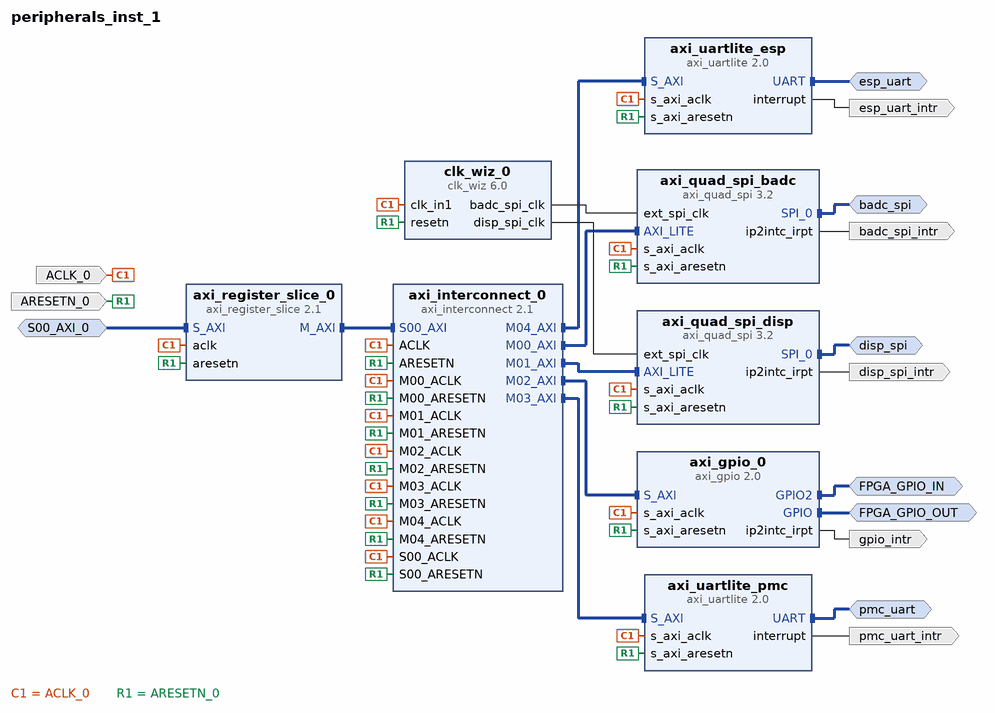
[diagram p0: block diagram of the top level]
# Vivado block design peripherals_inst_1, xc7z020clg484-2, Vivado 2024.1
create_bd_design peripherals_inst_1

create_bd_intf_port -mode Master -vlnv xilinx.com:interface:gpio_rtl:1.0 FPGA_GPIO_IN
create_bd_intf_port -mode Master -vlnv xilinx.com:interface:gpio_rtl:1.0 FPGA_GPIO_OUT
create_bd_intf_port -mode Master -vlnv xilinx.com:interface:spi_rtl:1.0 disp_spi
create_bd_intf_port -mode Master -vlnv xilinx.com:interface:spi_rtl:1.0 badc_spi
create_bd_intf_port -mode Slave -vlnv xilinx.com:interface:aximm_rtl:1.0 S00_AXI_0
create_bd_intf_port -mode Master -vlnv xilinx.com:interface:uart_rtl:1.0 pmc_uart
create_bd_intf_port -mode Master -vlnv xilinx.com:interface:uart_rtl:1.0 esp_uart
create_bd_port -dir I -type clk ACLK_0
create_bd_port -dir I -type rst ARESETN_0
create_bd_port -dir O -type intr pmc_uart_intr
create_bd_port -dir O -type intr esp_uart_intr
create_bd_port -dir O -type intr gpio_intr
create_bd_port -dir O -type intr disp_spi_intr
create_bd_port -dir O -type intr badc_spi_intr

create_bd_cell -type ip -vlnv xilinx.com:ip:clk_wiz:6.0 clk_wiz_0
set_property -dict [list \
  CONFIG.CLKIN1_JITTER_PS 500.0 \
  CONFIG.CLKIN1_UI_JITTER 0.1 \
  CONFIG.CLKIN2_JITTER_PS 100.0 \
  CONFIG.CLKIN2_UI_JITTER 0.010 \
  CONFIG.CLKOUT1_DRIVES BUFG \
  CONFIG.CLKOUT1_JITTER 1240.491 \
  CONFIG.CLKOUT1_PHASE_ERROR 313.282 \
  CONFIG.CLKOUT1_REQUESTED_OUT_FREQ 10 \
  CONFIG.CLKOUT2_DRIVES BUFG \
  CONFIG.CLKOUT2_JITTER 1054.702 \
  CONFIG.CLKOUT2_PHASE_ERROR 313.282 \
  CONFIG.CLKOUT2_REQUESTED_OUT_FREQ 20 \
  CONFIG.CLKOUT2_USED true \
  CONFIG.CLKOUT3_DRIVES BUFG \
  CONFIG.CLKOUT3_JITTER 1138.038 \
  CONFIG.CLKOUT3_PHASE_ERROR 155.540 \
  CONFIG.CLKOUT3_REQUESTED_OUT_FREQ 100.000 \
  CONFIG.CLKOUT3_USED false \
  CONFIG.CLKOUT4_DRIVES BUFG \
  CONFIG.CLKOUT4_JITTER 1138.038 \
  CONFIG.CLKOUT4_PHASE_ERROR 155.540 \
  CONFIG.CLKOUT4_REQUESTED_OUT_FREQ 100.000 \
  CONFIG.CLKOUT4_USED false \
  CONFIG.CLKOUT5_DRIVES BUFG \
  CONFIG.CLKOUT5_JITTER 675.381 \
  CONFIG.CLKOUT5_PHASE_ERROR 155.540 \
  CONFIG.CLKOUT5_REQUESTED_OUT_FREQ 100.000 \
  CONFIG.CLKOUT5_USED false \
  CONFIG.CLKOUT6_DRIVES BUFG \
  CONFIG.CLKOUT6_JITTER 214.814 \
  CONFIG.CLKOUT6_PHASE_ERROR 87.180 \
  CONFIG.CLKOUT6_REQUESTED_OUT_FREQ 100.000 \
  CONFIG.CLKOUT6_USED false \
  CONFIG.CLKOUT7_DRIVES BUFG \
  CONFIG.CLK_OUT1_PORT badc_spi_clk \
  CONFIG.CLK_OUT2_PORT disp_spi_clk \
  CONFIG.CLK_OUT3_PORT clk_out3 \
  CONFIG.CLK_OUT4_PORT clk_out4 \
  CONFIG.CLK_OUT5_PORT clk_out5 \
  CONFIG.CLK_OUT6_PORT clk_out6 \
  CONFIG.FEEDBACK_SOURCE FDBK_AUTO \
  CONFIG.JITTER_OPTIONS UI \
  CONFIG.MMCM_BANDWIDTH OPTIMIZED \
  CONFIG.MMCM_CLKFBOUT_MULT_F 41 \
  CONFIG.MMCM_CLKIN1_PERIOD 5.000 \
  CONFIG.MMCM_CLKIN2_PERIOD 10.0 \
  CONFIG.MMCM_CLKOUT0_DIVIDE_F 82 \
  CONFIG.MMCM_CLKOUT1_DIVIDE 41 \
  CONFIG.MMCM_CLKOUT2_DIVIDE 1 \
  CONFIG.MMCM_CLKOUT3_DIVIDE 1 \
  CONFIG.MMCM_CLKOUT4_DIVIDE 1 \
  CONFIG.MMCM_CLKOUT5_DIVIDE 1 \
  CONFIG.MMCM_COMPENSATION ZHOLD \
  CONFIG.MMCM_DIVCLK_DIVIDE 10 \
  CONFIG.MMCM_REF_JITTER1 0.100 \
  CONFIG.MMCM_REF_JITTER2 0.010 \
  CONFIG.NUM_OUT_CLKS 2 \
  CONFIG.PLL_CLKIN_PERIOD 5.000 \
  CONFIG.PRIMITIVE PLL \
  CONFIG.PRIM_SOURCE Global_buffer \
  CONFIG.RESET_PORT resetn \
  CONFIG.RESET_TYPE ACTIVE_LOW \
  CONFIG.SECONDARY_SOURCE Single_ended_clock_capable_pin \
  CONFIG.USE_LOCKED false \
  CONFIG.USE_PHASE_ALIGNMENT true \
] [get_bd_cells clk_wiz_0]
create_bd_cell -type ip -vlnv xilinx.com:ip:axi_interconnect:2.1 axi_interconnect_0
set_property -dict {CONFIG.NUM_MI 5 CONFIG.NUM_SI 1} [get_bd_cells axi_interconnect_0]
create_bd_cell -type ip -vlnv xilinx.com:ip:axi_register_slice:2.1 axi_register_slice_0
create_bd_cell -type ip -vlnv xilinx.com:ip:axi_quad_spi:3.2 axi_quad_spi_badc
set_property -dict [list \
  CONFIG.C_BYTE_LEVEL_INTERRUPT_EN 0 \
  CONFIG.C_FIFO_DEPTH 16 \
  CONFIG.C_SCK_RATIO 16 \
  CONFIG.C_USE_STARTUP 0 \
  CONFIG.C_XIP_MODE 0 \
  CONFIG.FIFO_INCLUDED 1 \
] [get_bd_cells axi_quad_spi_badc]
create_bd_cell -type ip -vlnv xilinx.com:ip:axi_quad_spi:3.2 axi_quad_spi_disp
set_property -dict [list \
  CONFIG.C_BYTE_LEVEL_INTERRUPT_EN 0 \
  CONFIG.C_FIFO_DEPTH 256 \
  CONFIG.C_SCK_RATIO 2 \
  CONFIG.C_TYPE_OF_AXI4_INTERFACE 0 \
  CONFIG.C_USE_STARTUP 0 \
  CONFIG.C_XIP_MODE 0 \
  CONFIG.FIFO_INCLUDED 1 \
  CONFIG.Master_mode 1 \
] [get_bd_cells axi_quad_spi_disp]
create_bd_cell -type ip -vlnv xilinx.com:ip:axi_gpio:2.0 axi_gpio_0
set_property -dict [list \
  CONFIG.C_ALL_INPUTS_2 1 \
  CONFIG.C_ALL_OUTPUTS 1 \
  CONFIG.C_GPIO2_WIDTH 8 \
  CONFIG.C_GPIO_WIDTH 23 \
  CONFIG.C_INTERRUPT_PRESENT 1 \
  CONFIG.C_IS_DUAL 1 \
] [get_bd_cells axi_gpio_0]
create_bd_cell -type ip -vlnv xilinx.com:ip:axi_uartlite:2.0 axi_uartlite_pmc
set_property -dict {CONFIG.C_BAUDRATE 115200} [get_bd_cells axi_uartlite_pmc]
create_bd_cell -type ip -vlnv xilinx.com:ip:axi_uartlite:2.0 axi_uartlite_esp
set_property -dict {CONFIG.C_BAUDRATE 115200} [get_bd_cells axi_uartlite_esp]

# ---- connections ----

connect_bd_intf_net -intf_net S00_AXI_0_1 [get_bd_intf_ports S00_AXI_0] [get_bd_intf_pins axi_register_slice_0/S_AXI]
connect_bd_intf_net [get_bd_intf_ports FPGA_GPIO_OUT] [get_bd_intf_pins axi_gpio_0/GPIO]
connect_bd_intf_net [get_bd_intf_ports FPGA_GPIO_IN] [get_bd_intf_pins axi_gpio_0/GPIO2]
connect_bd_intf_net [get_bd_intf_pins axi_quad_spi_badc/AXI_LITE] [get_bd_intf_pins axi_interconnect_0/M00_AXI]
connect_bd_intf_net [get_bd_intf_pins axi_quad_spi_disp/AXI_LITE] [get_bd_intf_pins axi_interconnect_0/M01_AXI]
connect_bd_intf_net [get_bd_intf_pins axi_gpio_0/S_AXI] [get_bd_intf_pins axi_interconnect_0/M02_AXI]
connect_bd_intf_net [get_bd_intf_pins axi_interconnect_0/M03_AXI] [get_bd_intf_pins axi_uartlite_pmc/S_AXI]
connect_bd_intf_net [get_bd_intf_pins axi_interconnect_0/M04_AXI] [get_bd_intf_pins axi_uartlite_esp/S_AXI]
connect_bd_intf_net -intf_net axi_quad_spi_0_SPI_0 [get_bd_intf_ports badc_spi] [get_bd_intf_pins axi_quad_spi_badc/SPI_0]
connect_bd_intf_net -intf_net axi_quad_spi_1_SPI_0 [get_bd_intf_ports disp_spi] [get_bd_intf_pins axi_quad_spi_disp/SPI_0]
connect_bd_intf_net [get_bd_intf_pins axi_register_slice_0/M_AXI] [get_bd_intf_pins axi_interconnect_0/S00_AXI]
connect_bd_intf_net -intf_net axi_uartlite_0_UART [get_bd_intf_ports pmc_uart] [get_bd_intf_pins axi_uartlite_pmc/UART]
connect_bd_intf_net [get_bd_intf_ports esp_uart] [get_bd_intf_pins axi_uartlite_esp/UART]
connect_bd_net -net ACLK_0_1 [get_bd_ports ACLK_0] \
  [get_bd_pins axi_gpio_0/s_axi_aclk] [get_bd_pins axi_interconnect_0/ACLK] [get_bd_pins axi_interconnect_0/S00_ACLK] \
  [get_bd_pins axi_interconnect_0/M00_ACLK] [get_bd_pins axi_interconnect_0/M01_ACLK] \
  [get_bd_pins axi_interconnect_0/M02_ACLK] [get_bd_pins axi_quad_spi_badc/s_axi_aclk] \
  [get_bd_pins axi_quad_spi_disp/s_axi_aclk] [get_bd_pins axi_register_slice_0/aclk] [get_bd_pins clk_wiz_0/clk_in1] \
  [get_bd_pins axi_uartlite_esp/s_axi_aclk] [get_bd_pins axi_uartlite_pmc/s_axi_aclk] \
  [get_bd_pins axi_interconnect_0/M03_ACLK] [get_bd_pins axi_interconnect_0/M04_ACLK]
connect_bd_net -net ARESETN_0_1 [get_bd_ports ARESETN_0] \
  [get_bd_pins axi_gpio_0/s_axi_aresetn] [get_bd_pins axi_interconnect_0/ARESETN] \
  [get_bd_pins axi_interconnect_0/S00_ARESETN] [get_bd_pins axi_interconnect_0/M00_ARESETN] \
  [get_bd_pins axi_interconnect_0/M01_ARESETN] [get_bd_pins axi_interconnect_0/M02_ARESETN] \
  [get_bd_pins axi_quad_spi_badc/s_axi_aresetn] [get_bd_pins axi_quad_spi_disp/s_axi_aresetn] \
  [get_bd_pins axi_register_slice_0/aresetn] [get_bd_pins clk_wiz_0/resetn] [get_bd_pins axi_uartlite_esp/s_axi_aresetn] \
  [get_bd_pins axi_uartlite_pmc/s_axi_aresetn] [get_bd_pins axi_interconnect_0/M03_ARESETN] \
  [get_bd_pins axi_interconnect_0/M04_ARESETN]
connect_bd_net [get_bd_pins axi_gpio_0/ip2intc_irpt] [get_bd_ports gpio_intr]
connect_bd_net [get_bd_pins axi_quad_spi_badc/ip2intc_irpt] [get_bd_ports badc_spi_intr]
connect_bd_net [get_bd_pins axi_quad_spi_disp/ip2intc_irpt] [get_bd_ports disp_spi_intr]
connect_bd_net [get_bd_pins axi_uartlite_esp/interrupt] [get_bd_ports esp_uart_intr]
connect_bd_net [get_bd_pins axi_uartlite_pmc/interrupt] [get_bd_ports pmc_uart_intr]
connect_bd_net [get_bd_pins clk_wiz_0/badc_spi_clk] [get_bd_pins axi_quad_spi_badc/ext_spi_clk]
connect_bd_net [get_bd_pins clk_wiz_0/disp_spi_clk] [get_bd_pins axi_quad_spi_disp/ext_spi_clk]

# ---- address map ----
assign_bd_address -offset 0x41200000 -range 64K -target_address_space [get_bd_addr_spaces S00_AXI_0] [get_bd_addr_segs axi_gpio_0/S_AXI/Reg]
assign_bd_address -offset 0x41E00000 -range 64K -target_address_space [get_bd_addr_spaces S00_AXI_0] [get_bd_addr_segs axi_quad_spi_badc/AXI_LITE/Reg]
assign_bd_address -offset 0x41E10000 -range 64K -target_address_space [get_bd_addr_spaces S00_AXI_0] [get_bd_addr_segs axi_quad_spi_disp/AXI_LITE/Reg]
assign_bd_address -offset 0x42C00000 -range 64K -target_address_space [get_bd_addr_spaces S00_AXI_0] [get_bd_addr_segs axi_uartlite_esp/S_AXI/Reg]
assign_bd_address -offset 0x42C10000 -range 64K -target_address_space [get_bd_addr_spaces S00_AXI_0] [get_bd_addr_segs axi_uartlite_pmc/S_AXI/Reg]

validate_bd_design
save_bd_design
